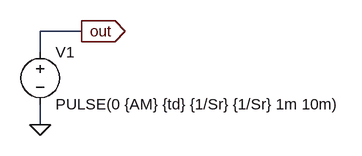
[diagram p0: schematic pulse.asc]
pulse.asc, the LTspice schematic file:
Version 4
SHEET 1 880 680
WIRE 144 64 80 64
WIRE 80 96 80 64
WIRE 80 208 80 176
FLAG 80 208 0
FLAG 144 64 out
IOPIN 144 64 Out
SYMBOL voltage 80 80 R0
WINDOW 123 0 0 Left 0
WINDOW 39 0 0 Left 0
SYMATTR InstName V1
SYMATTR Value PULSE(0 {AM} {td} {1/Sr} {1/Sr} 1m 10m)

The netlist it stands for:
* pulse.asc
V1 out 0 PULSE(0 {AM} {td} {1/Sr} {1/Sr} 1m 10m)
.backanno
.end